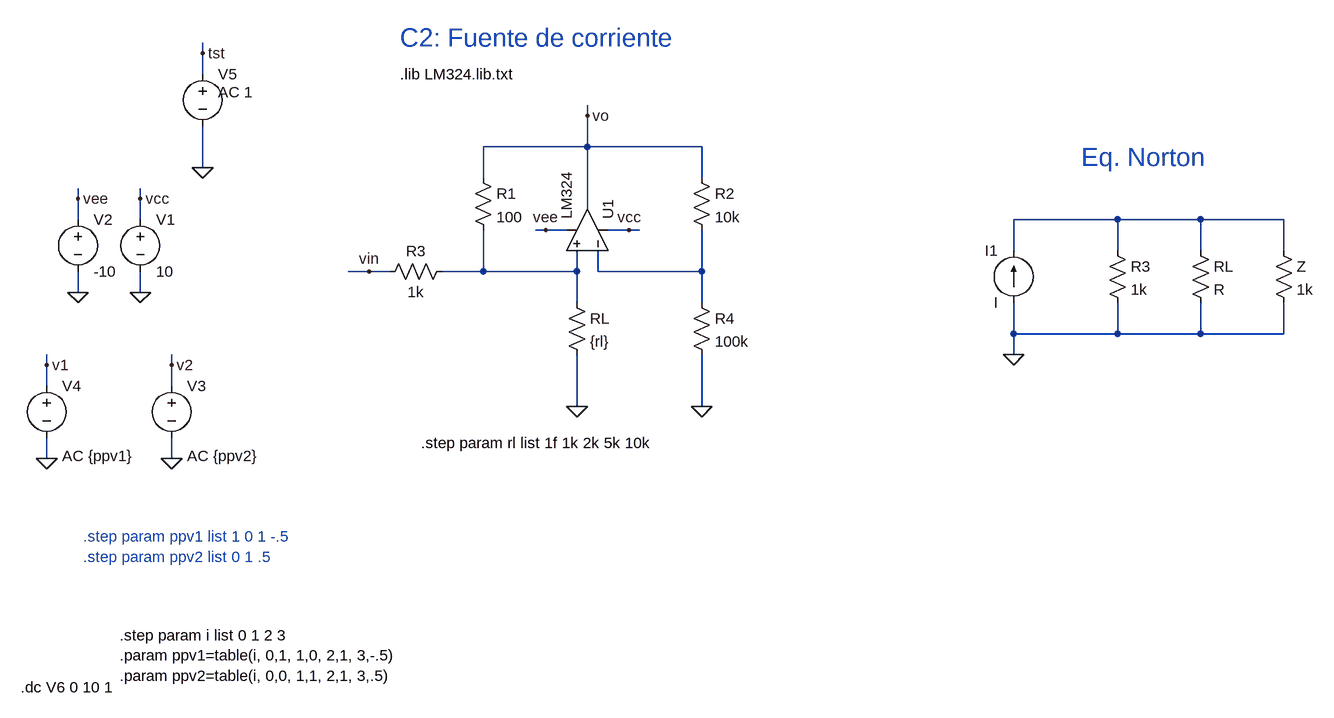
[diagram p0: schematic c2FuenteDeCorriente.asc]
c2FuenteDeCorriente.asc, the LTspice schematic file:
Version 4
SHEET 1 3064 680
WIRE -224 -448 -224 -464
WIRE -224 -416 -224 -448
WIRE 368 -352 368 -368
WIRE 368 -304 368 -352
WIRE 368 -304 208 -304
WIRE 544 -304 368 -304
WIRE -224 -272 -224 -336
WIRE 208 -256 208 -304
WIRE 544 -256 544 -304
WIRE -416 -224 -416 -240
WIRE -320 -224 -320 -240
WIRE 368 -208 368 -304
WIRE -416 -192 -416 -224
WIRE -320 -192 -320 -224
WIRE 1184 -192 1024 -192
WIRE 1312 -192 1184 -192
WIRE 1440 -192 1312 -192
WIRE 304 -176 288 -176
WIRE 336 -176 304 -176
WIRE 432 -176 400 -176
WIRE 448 -176 432 -176
WIRE 1024 -144 1024 -192
WIRE 1184 -144 1184 -192
WIRE 1312 -144 1312 -192
WIRE 1440 -144 1440 -192
WIRE 32 -112 0 -112
WIRE 64 -112 32 -112
WIRE 208 -112 208 -176
WIRE 208 -112 144 -112
WIRE 352 -112 352 -144
WIRE 352 -112 208 -112
WIRE 384 -112 384 -144
WIRE 544 -112 544 -176
WIRE 544 -112 384 -112
WIRE -416 -80 -416 -112
WIRE -320 -80 -320 -112
WIRE 352 -64 352 -112
WIRE 544 -64 544 -112
WIRE 1024 -16 1024 -64
WIRE 1184 -16 1184 -64
WIRE 1184 -16 1024 -16
WIRE 1312 -16 1312 -64
WIRE 1312 -16 1184 -16
WIRE 1440 -16 1440 -64
WIRE 1440 -16 1312 -16
WIRE 1024 16 1024 -16
WIRE -464 32 -464 16
WIRE -272 32 -272 16
WIRE -464 64 -464 32
WIRE -272 64 -272 32
WIRE 352 96 352 16
WIRE 544 96 544 16
WIRE -464 176 -464 144
WIRE -272 176 -272 144
FLAG -320 -80 0
FLAG -320 -224 vcc
FLAG -416 -80 0
FLAG -416 -224 vee
FLAG -272 176 0
FLAG -272 32 v2
FLAG -464 176 0
FLAG -464 32 v1
FLAG 304 -176 vee
FLAG 432 -176 vcc
FLAG 544 96 0
FLAG -224 -272 0
FLAG -224 -448 tst
FLAG 352 96 0
FLAG 32 -112 vin
FLAG 368 -352 vo
FLAG 1024 16 0
SYMBOL voltage -320 -208 R0
WINDOW 123 0 0 Left 0
WINDOW 39 0 0 Left 0
SYMATTR InstName V1
SYMATTR Value 10
SYMBOL voltage -416 -208 R0
WINDOW 123 0 0 Left 0
WINDOW 39 0 0 Left 0
SYMATTR InstName V2
SYMATTR Value -10
SYMBOL voltage -272 48 R0
WINDOW 123 24 124 Left 2
WINDOW 39 0 0 Left 0
SYMATTR Value2 AC {ppv2}
SYMATTR InstName V3
SYMATTR Value ""
SYMBOL voltage -464 48 R0
WINDOW 123 24 124 Left 2
WINDOW 39 0 0 Left 0
SYMATTR Value2 AC {ppv1}
SYMATTR InstName V4
SYMATTR Value ""
SYMBOL voltage -224 -432 R0
WINDOW 123 24 44 Left 2
WINDOW 39 0 0 Left 0
SYMATTR Value2 AC 1
SYMATTR InstName V5
SYMATTR Value ""
SYMBOL res 192 -272 R0
SYMATTR InstName R1
SYMATTR Value 100
SYMBOL res 528 -272 R0
SYMATTR InstName R2
SYMATTR Value 10k
SYMBOL res 160 -128 R90
WINDOW 0 0 56 VBottom 2
WINDOW 3 32 56 VTop 2
SYMATTR InstName R3
SYMATTR Value 1k
SYMBOL res 528 -80 R0
SYMATTR InstName R4
SYMATTR Value 100k
SYMBOL res 336 -80 R0
SYMATTR InstName RL
SYMATTR Value {rl}
SYMBOL OpAmps\\opamp2 432 -176 M270
SYMATTR InstName U1
SYMATTR Value LM324
SYMBOL current 1024 -64 R180
WINDOW 0 24 80 Left 2
WINDOW 3 24 0 Left 2
SYMATTR InstName I1
SYMBOL res 1168 -160 R0
SYMATTR InstName R3
SYMATTR Value 1k
SYMBOL res 1296 -160 R0
SYMATTR InstName RL
SYMBOL res 1424 -160 R0
SYMATTR InstName Z
SYMATTR Value 1k
TEXT -408 296 Left 2 ;.step param ppv1 list 1 0 1 -.5\n.step param ppv2 list 0 1 .5
TEXT -352 448 Left 2 !.step param i list 0 1 2 3\n.param ppv1=table(i, 0,1, 1,0, 2,1, 3,-.5)\n.param ppv2=table(i, 0,0, 1,1, 2,1, 3,.5)
TEXT -504 528 Left 2 !.dc V6 0 10 1
TEXT 80 -472 Left 4 ;C2: Fuente de corriente
TEXT 80 -416 Left 2 !.lib LM324.lib.txt
TEXT 112 152 Left 2 !.step param rl list 1f 1k 2k 5k 10k
TEXT 1128 -288 Left 4 ;Eq. Norton

The netlist it stands for:
* c2FuenteDeCorriente.asc
V1 vcc 0 10
V2 vee 0 -10
V3 v2 0 AC {ppv2}
V4 v1 0 AC {ppv1}
V5 tst 0 AC 1
R1 vo N002 100
R2 vo N003 10k
R3 N002 vin 1k
R4 N003 0 100k
RL N002 0 {rl}
XU1 N002 N003 vcc vee vo LM324  ; pins In+ In- V+ V- OUT
I1 0 N001 I
R3 N001 0 1k
RL N001 0 R
R§Z N001 0 1k
* .step param ppv1 list 1 0 1 -.5
* .step param ppv2 list 0 1 .5
.step param i list 0 1 2 3
.param ppv1=table(i, 0,1, 1,0, 2,1, 3,-.5)
.param ppv2=table(i, 0,0, 1,1, 2,1, 3,.5)
.dc V6 0 10 1
* C2: Fuente de corriente
.lib LM324.lib.txt
.step param rl list 1f 1k 2k 5k 10k
* Eq. Norton
.backanno
.end